# Altium schematic sheet 82230KPC-1-K-1V0-241216.SchDoc: Cloud39EV300_AK3918EV300_IP OUTDOOR
size A3; Revision: V2.0.0; 大法师法师东风大法师: 对方是否; PCBVersion: V1.0
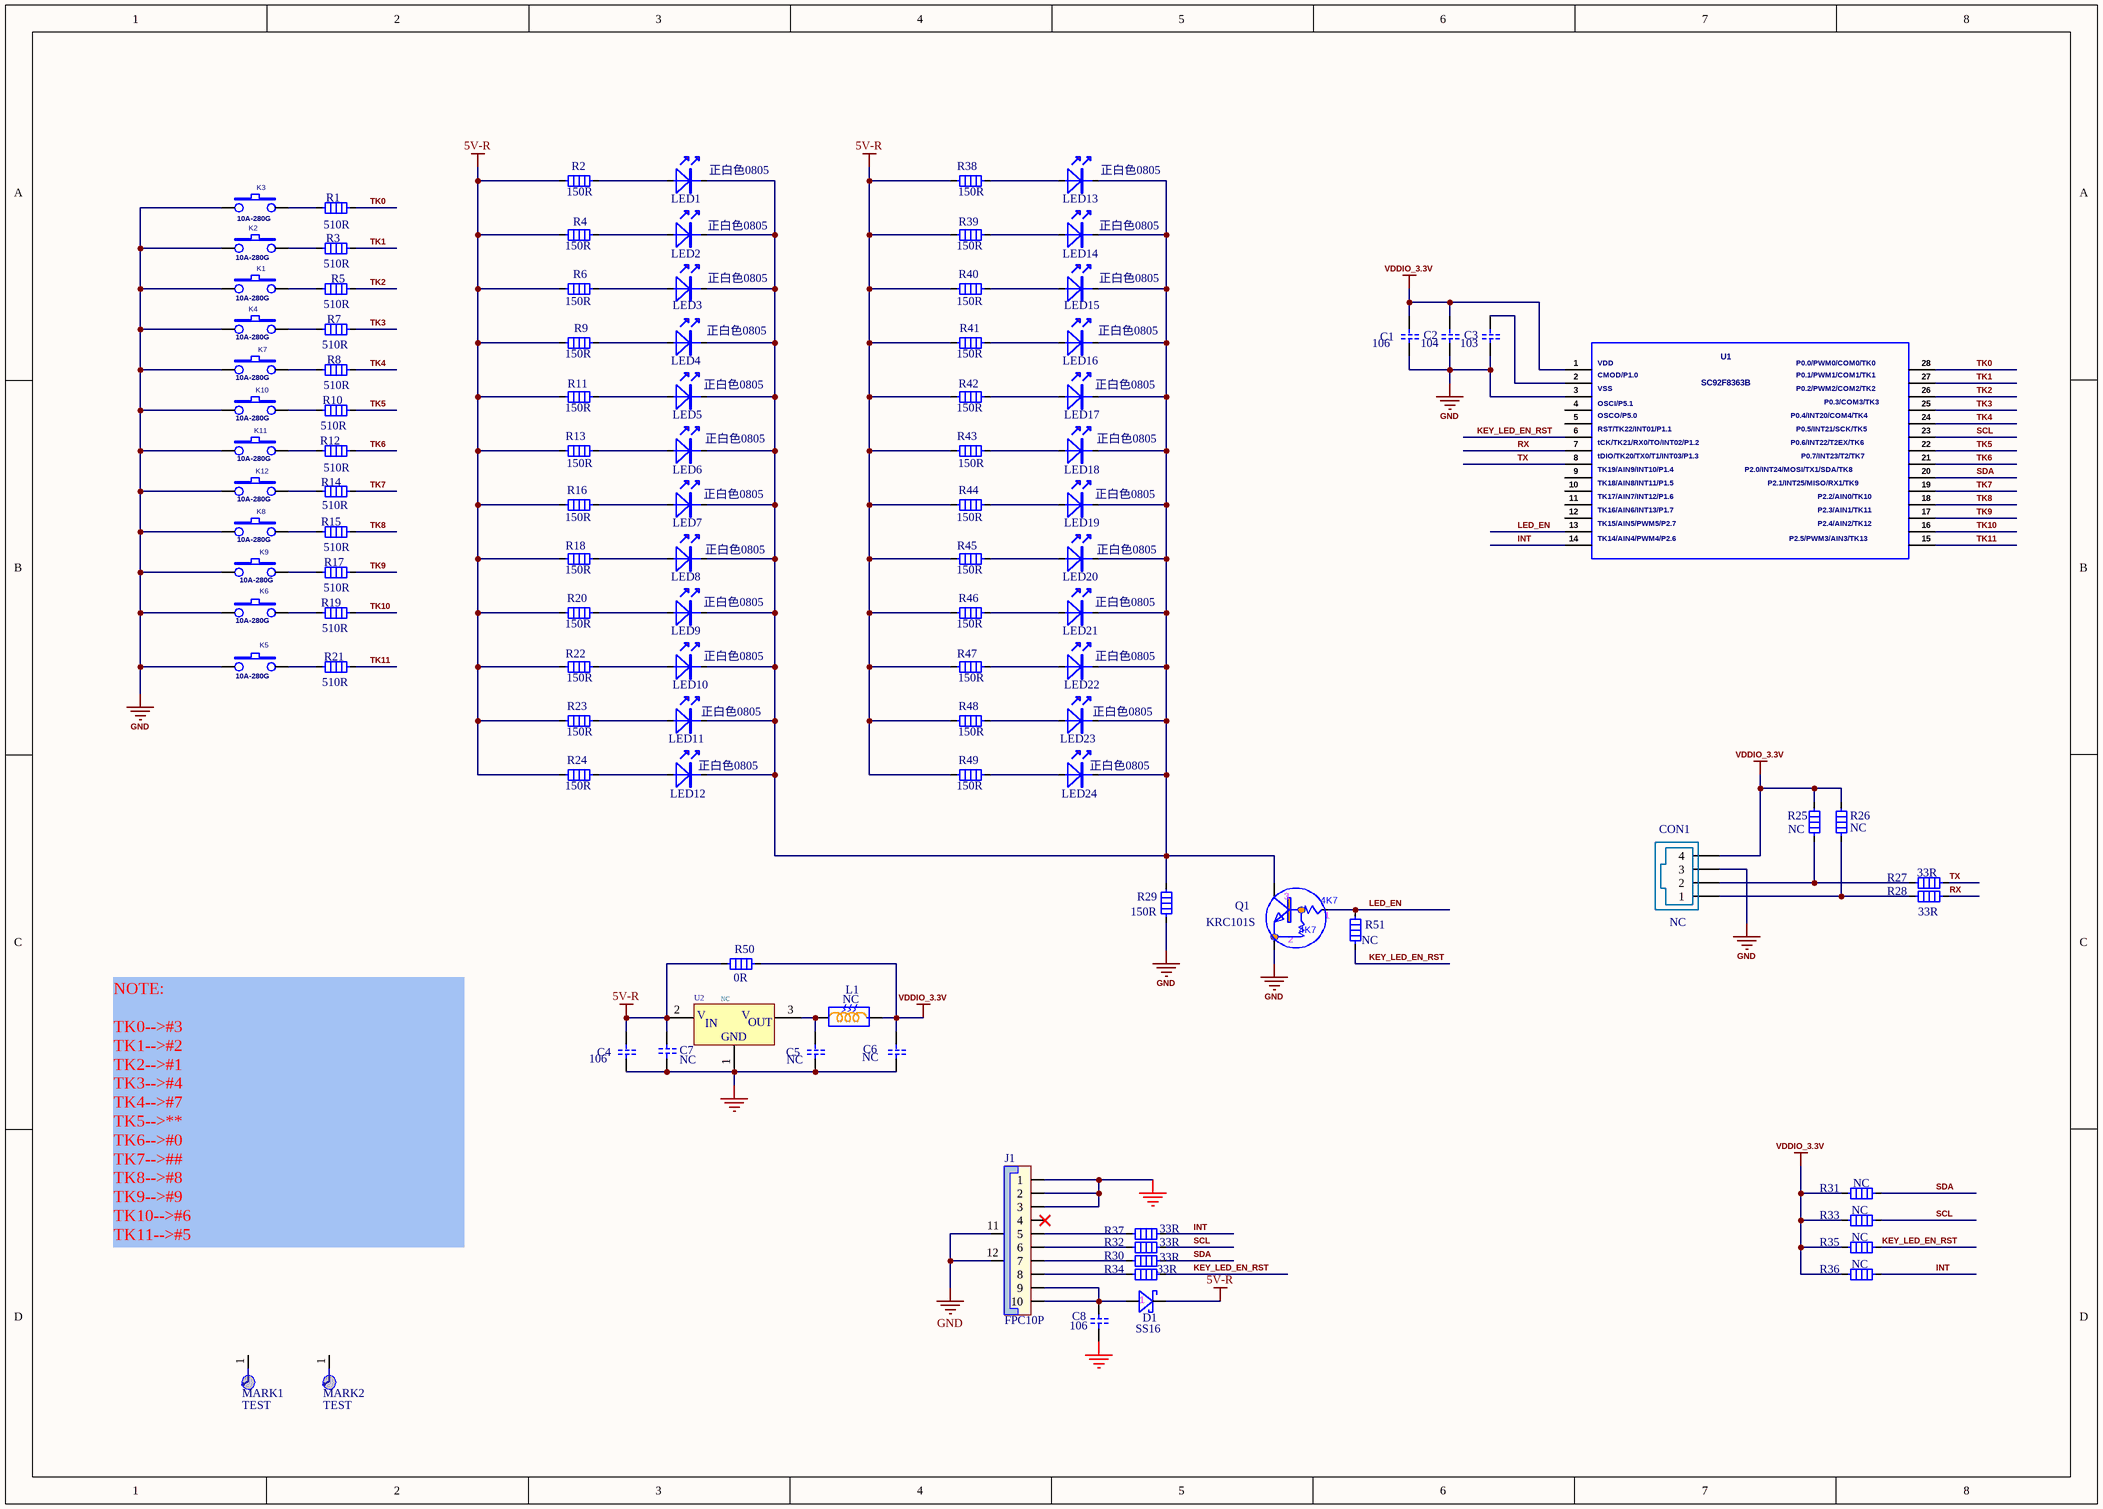
[diagram p0: 82230KPC-1-K-1V0-241216.SchDoc]

## Parts
C1  106  [C0603-Z]
C2  104  [C0603-Z]
C3  103  [C0603-Z]
C4  106  [C0603-Z]
C5  NC  [C0603-Z]
C6  NC  [C0603-Z]
C7  NC  [C0603-Z]
C8  106  [C0603-Z]
CON1  NC  [PH4P2.0_VS-Z]
D1  SS16  [SMAF-Z]
J1  FPC10P  [FPC10_0.5-Z]
K1  10A-280G  [SD-9X9-S]
K2  10A-280G  [SD-9X9-S]
K3  10A-280G  [SD-9X9-S]
K4  10A-280G  [SD-9X9-S]
K5  10A-280G  [SD-9X9-S]
K6  10A-280G  [SD-9X9-S]
K7  10A-280G  [SD-9X9-S]
K8  10A-280G  [SD-9X9-S]
K9  10A-280G  [SD-9X9-S]
K10  10A-280G  [SD-9X9-S]
K11  10A-280G  [SD-9X9-S]
K12  10A-280G  [SD-9X9-S]
L1  NC  [L0805-Z]
LED1  正白色0805  [LED0805AK-X]
LED2  正白色0805  [LED0805AK-X]
LED3  正白色0805  [LED0805AK-X]
LED4  正白色0805  [LED0805AK-X]
LED5  正白色0805  [LED0805AK-X]
LED6  正白色0805  [LED0805AK-X]
LED7  正白色0805  [LED0805AK-X]
LED8  正白色0805  [LED0805AK-X]
LED9  正白色0805  [LED0805AK-X]
LED10  正白色0805  [LED0805AK-X]
LED11  正白色0805  [LED0805AK-X]
LED12  正白色0805  [LED0805AK-X]
LED13  正白色0805  [LED0805AK-X]
LED14  正白色0805  [LED0805AK-X]
LED15  正白色0805  [LED0805AK-X]
LED16  正白色0805  [LED0805AK-X]
LED17  正白色0805  [LED0805AK-X]
LED18  正白色0805  [LED0805AK-X]
LED19  正白色0805  [LED0805AK-X]
LED20  正白色0805  [LED0805AK-X]
LED21  正白色0805  [LED0805AK-X]
LED22  正白色0805  [LED0805AK-X]
LED23  正白色0805  [LED0805AK-X]
LED24  正白色0805  [LED0805AK-X]
MARK1  TEST  [MARK1]  (no BOM)
MARK2  TEST  [MARK1]  (no BOM)
Q1  KRC101S  [SOT23_Z]
R1  510R  [R0603-Z]
R2  150R  [R0603-Z]
R3  510R  [R0603-Z]
R4  150R  [R0603-Z]
R5  510R  [R0603-Z]
R6  150R  [R0603-Z]
R7  510R  [R0603-Z]
R8  510R  [R0603-Z]
R9  150R  [R0603-Z]
R10  510R  [R0603-Z]
R11  150R  [R0603-Z]
R12  510R  [R0603-Z]
R13  150R  [R0603-Z]
R14  510R  [R0603-Z]
R15  510R  [R0603-Z]
R16  150R  [R0603-Z]
R17  510R  [R0603-Z]
R18  150R  [R0603-Z]
R19  510R  [R0603-Z]
R20  150R  [R0603-Z]
R21  510R  [R0603-Z]
R22  150R  [R0603-Z]
R23  150R  [R0603-Z]
R24  150R  [R0603-Z]
R25  NC  [R0603-Z]
R26  NC  [R0603-Z]
R27  33R  [R0603-Z]
R28  33R  [R0603-Z]
R29  150R  [R0603-Z]
R30  33R  [R0603-Z]
R31  NC  [R0603-Z]
R32  33R  [R0603-Z]
R33  NC  [R0603-Z]
R34  33R  [R0603-Z]
R35  NC  [R0603-Z]
R36  NC  [R0603-Z]
R37  33R  [R0603-Z]
R38  150R  [R0603-Z]
R39  150R  [R0603-Z]
R40  150R  [R0603-Z]
R41  150R  [R0603-Z]
R42  150R  [R0603-Z]
R43  150R  [R0603-Z]
R44  150R  [R0603-Z]
R45  150R  [R0603-Z]
R46  150R  [R0603-Z]
R47  150R  [R0603-Z]
R48  150R  [R0603-Z]
R49  150R  [R0603-Z]
R50  0R  [R0603-Z]
R51  NC  [R0603-Z]
U1  SC92F8363B  [SSOP28-Z]
U2  NC  [SOT-89-Z]

## Nets
5V-R: C4.1 C7.2 D1.2(K) R2.2 R4.2 R6.2 R9.2 R11.2 R13.2 R16.2 R18.2 R20.2 R22.2 R23.2 R24.2 R38.2 R39.2 R40.2 R41.2 R42.2 R43.2 R44.2 R45.2 R46.2 R47.2 R48.2 R49.2 R50.1 U2.2(VIN)
GND: C1.2 C2.2 C3.2 C4.2 C5.2 C6.2 C7.1 C8.1 CON1.3 J1.1 J1.2 J1.3 J1.11 J1.12 K1.2 K2.2 K3.2 K4.2 K5.2 K6.2 K7.2 K8.2 K9.2 K10.2 K11.2 K12.2 Q1.2(E) R29.2 U1.3 U2.1(GND)
VDDIO_3.3V: C1.1 C2.1 C6.1 CON1.4 L1.2 R25.1 R26.1 R31.2 R33.2 R35.2 R36.2 R50.2 U1.1
INT: R36.1 R37.1 U1.14
KEY_LED_EN_RST: R34.1 R35.1 R51.1 U1.6
LED_EN: Q1.1(B) R51.2 U1.13
RX: R28.1 U1.7
SCL: R32.1 R33.1 U1.23
SDA: R30.1 R31.1 U1.20
TK0: R1.1 U1.28
TK1: R3.1 U1.27
TK2: R5.1 U1.26
TK3: R7.1 U1.25
TK4: R8.1 U1.24
TK5: R10.1 U1.22
TK6: R12.1 U1.21
TK7: R14.1 U1.19
TK8: R15.1 U1.18
TK9: R17.1 U1.17
TK10: R19.1 U1.16
TK11: R21.1 U1.15
TX: R27.1 U1.8
NetC3_1: C3.1 U1.2
NetC5_1: C5.1 L1.1 U2.3(VOUT)
NetC8_2: C8.2 D1.1(A) J1.9 J1.10
NetCON1_1: CON1.1 R26.2 R28.2
NetCON1_2: CON1.2 R25.2 R27.2
NetJ1_5: J1.5 R37.2
NetJ1_6: J1.6 R32.2
NetJ1_7: J1.7 R30.2
NetJ1_8: J1.8 R34.2
NetK1_1: K1.1 R5.2
NetK2_1: K2.1 R3.2
NetK3_1: K3.1 R1.2
NetK4_1: K4.1 R7.2
NetK5_1: K5.1 R21.2
NetK6_1: K6.1 R19.2
NetK7_1: K7.1 R8.2
NetK8_1: K8.1 R15.2
NetK9_1: K9.1 R17.2
NetK10_1: K10.1 R10.2
NetK11_1: K11.1 R12.2
NetK12_1: K12.1 R14.2
NetLED1_1: LED1.1 R2.1
NetLED1_2: LED1.2 LED2.2 LED3.2 LED4.2 LED5.2 LED6.2 LED7.2 LED8.2 LED9.2 LED10.2 LED11.2 LED12.2 LED13.2 LED14.2 LED15.2 LED16.2 LED17.2 LED18.2 LED19.2 LED20.2 LED21.2 LED22.2 LED23.2 LED24.2 Q1.3(C) R29.1
NetLED2_1: LED2.1 R4.1
NetLED3_1: LED3.1 R6.1
NetLED4_1: LED4.1 R9.1
NetLED5_1: LED5.1 R11.1
NetLED6_1: LED6.1 R13.1
NetLED7_1: LED7.1 R16.1
NetLED8_1: LED8.1 R18.1
NetLED9_1: LED9.1 R20.1
NetLED10_1: LED10.1 R22.1
NetLED11_1: LED11.1 R23.1
NetLED12_1: LED12.1 R24.1
NetLED13_1: LED13.1 R38.1
NetLED14_1: LED14.1 R39.1
NetLED15_1: LED15.1 R40.1
NetLED16_1: LED16.1 R41.1
NetLED17_1: LED17.1 R42.1
NetLED18_1: LED18.1 R43.1
NetLED19_1: LED19.1 R44.1
NetLED20_1: LED20.1 R45.1
NetLED21_1: LED21.1 R46.1
NetLED22_1: LED22.1 R47.1
NetLED23_1: LED23.1 R48.1
NetLED24_1: LED24.1 R49.1

Not connected (* = marked no-connect by the designer): J1 4*; MARK1 1; MARK2 1; U1 4 5 9 10 11 12

## Notes on the sheet
- NOTE:
  TK0-->#3
  TK1-->#2
  TK2-->#1
  TK3-->#4
  TK4-->#7
  TK5-->**
  TK6-->#0
  TK7-->##
  TK8-->#8
  TK9-->#9
  TK10-->#6
  TK11-->#5
- (in symbol 7905) V; IN; OUT
- (in symbol KRC101S) 4K7
- (in symbol SC92F8363B) VDD; P0.0/PWM0/COM0/TK0; CMOD/P1.0; P0.1/PWM1/COM1/TK1; VSS; P0.2/PWM2/COM2/TK2; OSCI/P5.1; P0.3/COM3/TK3; OSCO/P5.0; P0.4/INT20/COM4/TK4; RST/TK22/INT01/P1.1; P0.5/INT21/SCK/TK5; tCK/TK21/RX0/TO/INT02/P1.2; P0.6/INT22/T2EX/TK6; tDIO/TK20/TX0/T1/INT03/P1.3; P0.7/INT23/T2/TK7; TK19/AIN9/INT10/P1.4; P2.0/INT24/MOSI/TX1/SDA/TK8; TK18/AIN8/INT11/P1.5; P2.1/INT25/MISO/RX1/TK9; TK17/AIN7/INT12/P1.6; P2.2/AIN0/TK10; TK16/AIN6/INT13/P1.7; P2.3/AIN1/TK11; TK15/AIN5/PWM5/P2.7; P2.4/AIN2/TK12; TK14/AIN4/PWM4/P2.6; P2.5/PWM3/AIN3/TK13

## Library data of the parts
C1 C4-C6 C8 = 106_6V3_0603: 电容器，0603贴片，106, 6V3 精度20%; CODE: A.12060310600003; KIND: KINDD; PINN: 2; NUM: 10000000; CLASS: CC03; SUB-CLS: 6.3; VALUE: 106_6V3_0603
C2 C7 = 104_50V_0603: 电容器，0603贴片，104, 50V 精度10%; CODE: A.12060310400003; KIND: KINDB; PINN: 2; NUM: 100000; CLASS: CC03; SUB-CLS: 50; VALUE: 104_50V_0603
C3 = 103_50V_0603: 电容器，0603贴片，103, 50V 精度10%; CODE: A.12060310300002; KIND: KINDE; PINN: 2; NUM: 10000; CLASS: CC03; SUB-CLS: 50; VALUE: 103_50V_0603
CON1 = PH4P-S-DIP: 4PIN直插插座（银针外露2.5mm，数据参考看上方物料图片）,4PIN插座 脚距2.0mm 插座180°米色耐高温  SCD2001AZ-104139; CODE: A.22120000400001; NUM: 2; CLASS: CONN-DIP; KIND: KINDD; PINN: 4; VALUE: PH4P-S-DIP; Updated time: 2023.11.06
D1 = SS16: 贴片肖特基二极管，SMAF SS16（印字SS16）; CLASS: Schottky; KIND: KINDA; PINN: 2; CODE: A.15400701600001; TIP: VR=60V  IF=1A  VF=0.7V; Updated time: 2023.10.22; DATASHEET: YES
J1 = FPC10P_0.5_LFC: FPC连接器 软排线插座 间距0.5mm 10P 下接触 卧贴翻盖式 (卓誉佳）（编带式）; CODE: A.22000501000002; NUM: 10; CLASS: FPC-SOCKET-0.5; KIND: KINDC; VALUE: FPC10P_0.5_LFC; PINN: 10; Updated time: 2023.11.06
K1-K12 = KEY_4P_SMD_6X6MM: 锅仔片; Part Number_AK: SWKS04001XX; Value: 6X6X4.3; PCB DECAL: KEY_4P_SMD_6X6MM
L1 = 220R_2.5A_0805: 磁珠 0805贴片 2.5A 220ohm@100MHZ DCR=0.050; CODE: A.23080522000001; KIND: KINDC; PINN: 2; CLASS: IND-B; VALUE: 220R_2.5A_0805
LED1-LED24 = 正白色0805: 贴片发光二极管, 0805贴片LED 正白色 发光二极管; KIND: KINDC; PINN: 2; CODE: A.18080540000001; CLASS: LED-0805; Updated time: 2023.10.22; VALUE: 正白色0805; TIP: 0805贴片LED 正白色; DATASHEET: NO
Q1 = KRC101S: 贴片三极管，KRC101S  SOT-23 NPN型带阻三极管; CLASS: NPN-R2; KIND: KINDA; PINN: 3; CODE: A.16112301010001; TIP: R1=R2=4K7 VCEO=50V IC=0.1A PC=0.2W; VALUE: KRC101S; Updated time: 2023.10.22; DATASHEET: YES
R1 R3 R5 R7 R8 R10 R12 R14 R15 R17 R19 R21 = 510R_0603_5%: 电阻器，0603贴片，510R,精度5%; CLASS: RES0603-0.05; CODE: A.11060351000001; KIND: KINDC; PINN: 2; NUM: 510; VALUE: 510R_0603_5%; Updated time: 2023.09.28
R2 R4 R6 R9 R11 R13 R16 R18 R20 R22-R24 R29 R38-R49 = 150R_0603_5%: 电阻器，0603贴片，150R,精度5%; CLASS: RES0603-0.05; CODE: A.11060315000001; KIND: KINDC; PINN: 2; NUM: 150; VALUE: 150R_0603_5%; Updated time: 2023.09.28
R25 R26 R31 R33 R35 R36 = 10K_0603_5%: 电阻器，0603贴片，10K,精度5%; CLASS: RES0603-0.05; CODE: A.11060310300001; KIND: KINDC; PINN: 2; NUM: 10000; VALUE: 10K_0603_5%; Updated time: 2023.09.28
R27 R28 R30 R32 R34 R37 = 33R_0603_5%: 电阻器，0603贴片，33R,精度5%; CLASS: RES0603-0.05; CODE: A.11060303300001; KIND: KINDC; PINN: 2; NUM: 33; VALUE: 33R_0603_5%; Updated time: 2023.09.28
R50 R51 = 0R_0603_5%: 电阻器，0603贴片，0R,精度5%; CLASS: RES0603-0.05; CODE: A.11060300000001; KIND: KINDC; PINN: 2; NUM: 0; VALUE: 0R_0603_5%; Updated time: 2023.09.28
U1 = SC92F8363B: PCB DECAL: SSOP-28_L10.2-W5.3-P0.65-LS7.8-TL
U2 = 7905: 三端稳压器，三端稳压器HT7533 电流100mA SOT-89; CODE: A.24118975330001